# Altium project power_interface.PrjPcb
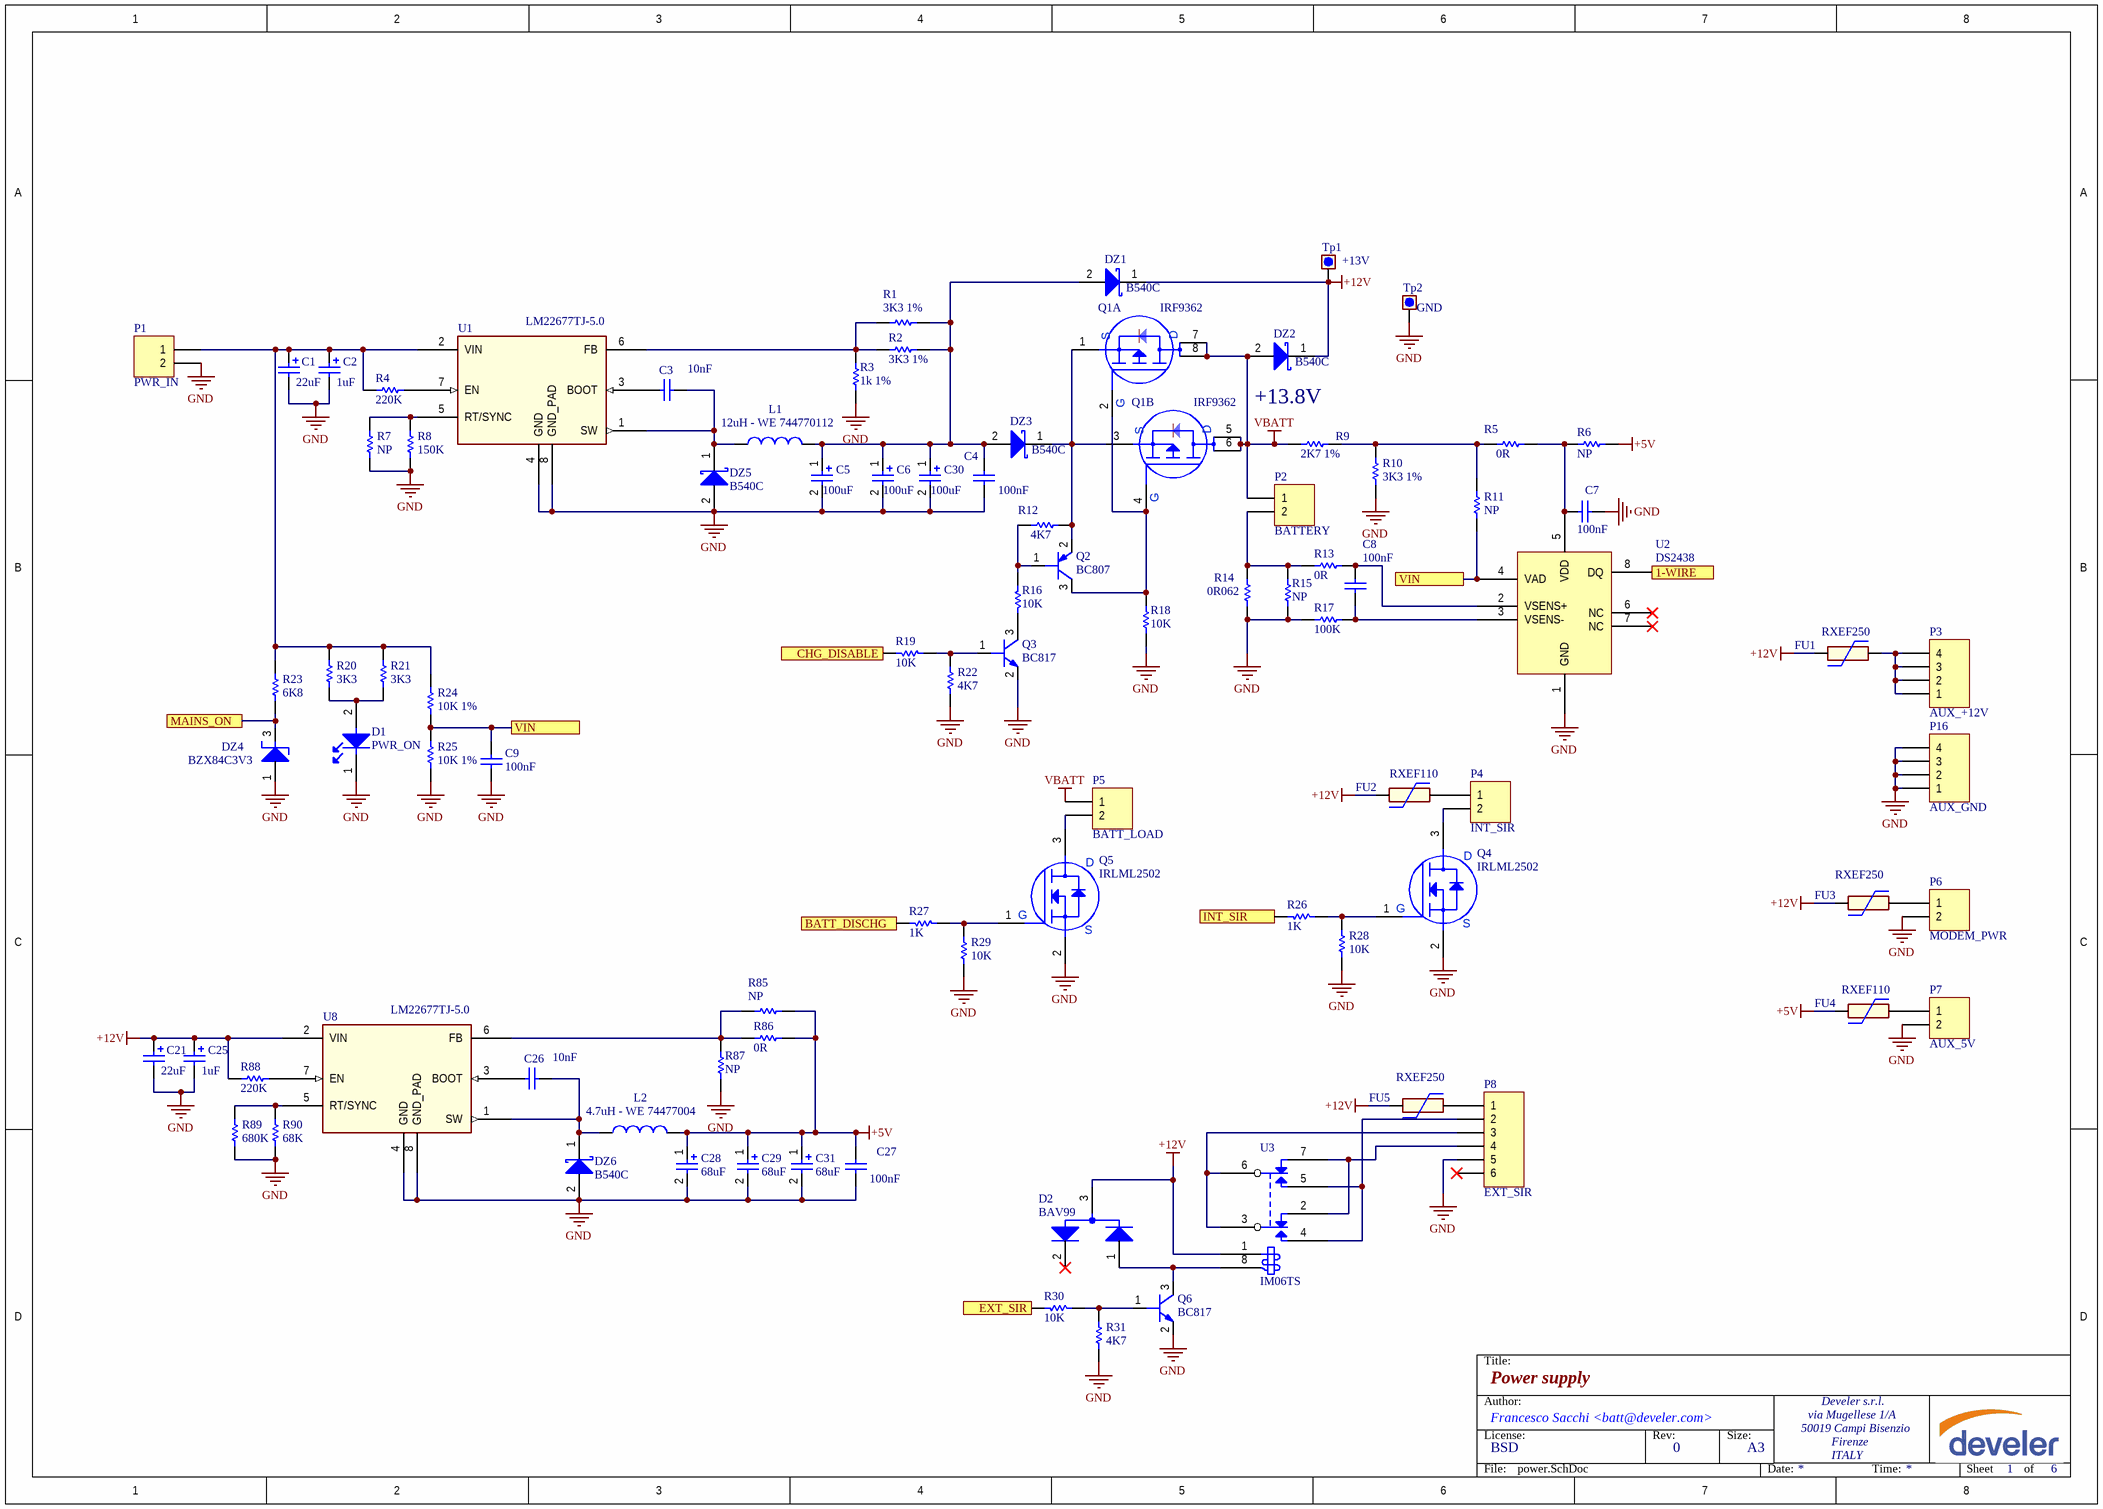
[diagram p0: power.SchDoc]
Title: Test
3 sheets, 181 parts. Net scope: flat (ports and power ports of the same name join across sheets).
Board file: power_interface.PcbDoc
Sheets:
  power.SchDoc
  interface.SchDoc
  raspberry_connector.SchDoc

## Sheet power.SchDoc: Power supply
size A3; Author: Francesco Sacchi <batt@develer.com>; Organization: Develer s.r.l.; Address1: via Mugellese 1/A; Address2: 50019 Campi Bisenzio; Address3: Firenze; Address4: ITALY; DocumentNumber: 1; Revision: 0; SheetNumber: 1; SheetTotal: 6

### Parts
C1  22uF  [1206_[3216]]
C2  1uF  [1206_[3216]]
C3  10nF  [0603_[1608]]
C4  100nF  [0603_[1608]]
C5  100uF  [[7343]_CAP_TAN]
C6  100uF  [[7343]_CAP_TAN]
C7  100nF  [0603_[1608]]
C8  100nF  [0603_[1608]]
C9  100nF  [0603_[1608]]
C21  22uF  [1206_[3216]]
C25  1uF  [1206_[3216]]
C26  10nF  [0603_[1608]]
C27  100nF  [0603_[1608]]
C28  68uF  [[7343]_CAP_TAN]
C29  68uF  [[7343]_CAP_TAN]
C30  100uF  [[7343]_CAP_TAN]
C31  68uF  [[7343]_CAP_TAN]
D1  PWR_ON  [0805_[2012]_LED]
D2  BAV99  [SOT-23]
DZ1  B540C  [DO214AB_K1-A2_SMC]
DZ2  B540C  [DO214AB_K1-A2_SMC]
DZ3  B540C  [DO214AB_K1-A2_SMC]
DZ4  BZX84C3V3  [SOT-23_L]
DZ5  B540C  [DO214AB_K1-A2_SMC]
DZ6  B540C  [DO214AB_K1-A2_SMC]
FU1  RXEF250  [RADIAL-10.2mm-polyswitch]
FU2  RXEF110  [RADIAL_5.08mm_polyswitch]
FU3  RXEF250  [RADIAL-10.2mm-polyswitch]
FU4  RXEF110  [RADIAL_5.08mm_polyswitch]
FU5  RXEF250  [RADIAL-10.2mm-polyswitch]
L1  12uH - WE 744770112  [WE-PD_1280]
L2  4.7uH - WE 74477004  [WE-PD_1280]
P1  PWR_IN  [TBLOCK_1X2_3.5MM_HOR_THD]
P2  BATTERY  [TBLOCK_1X2_3.5MM_HOR_THD]
P3  AUX_+12V  [TBLOCK_1X4_3.5MM_HOR_THD]
P4  INT_SIR  [TBLOCK_1X2_3.5MM_HOR_THD]
P5  BATT_LOAD  [TBLOCK_1X2_3.5MM_HOR_THD]
P6  MODEM_PWR  [TBLOCK_1X2_3.5MM_HOR_THD]
P7  AUX_5V  [TBLOCK_1X2_3.5MM_HOR_THD]
P8  EXT_SIR  [TBLOCK_1X6_3.5MM_HOR_THD]
P16  AUX_GND  [TBLOCK_1X4_3.5MM_HOR_THD]
Q1  IRF9362  [SOIC8]  (parts A,B of 2)
Q2  BC807  [SOT-23]
Q3  BC817  [SOT-23]
Q4  IRLML2502  [sot-23]
Q5  IRLML2502  [sot-23]
Q6  BC817  [SOT-23]
R1  3K3 1%  [0603_[1608]]
R2  3K3 1%  [0603_[1608]]
R3  1k 1%  [0603_[1608]]
R4  220K  [0603_[1608]]
R5  0R  [0603_[1608]]
R6  NP  [0603_[1608]]
R7  NP  [0603_[1608]]
R8  150K  [0603_[1608]]
R9  2K7 1%  [0603_[1608]]
R10  3K3 1%  [0603_[1608]]
R11  NP  [0603_[1608]]
R12  4K7  [0603_[1608]]
R13  0R  [0603_[1608]]
R14  0R062  [1020_[2550]]
R15  NP  [0603_[1608]]
R16  10K  [0603_[1608]]
R17  100K  [0603_[1608]]
R18  10K  [0603_[1608]]
R19  10K  [0603_[1608]]
R20  3K3  [0603_[1608]]
R21  3K3  [0603_[1608]]
R22  4K7  [0603_[1608]]
R23  6K8  [0603_[1608]]
R24  10K 1%  [0603_[1608]]
R25  10K 1%  [0603_[1608]]
R26  1K  [0603_[1608]]
R27  1K  [0603_[1608]]
R28  10K  [0603_[1608]]
R29  10K  [0603_[1608]]
R30  10K  [0603_[1608]]
R31  4K7  [0603_[1608]]
R85  NP  [0603_[1608]]
R86  0R  [0603_[1608]]
R87  NP  [0603_[1608]]
R88  220K  [0603_[1608]]
R89  680K  [0603_[1608]]
R90  68K  [0603_[1608]]
Tp1  +13V  [TEST_POINT_THD_D1.6MM]  (no BOM)
Tp2  GND  [TEST_POINT_THD_D1.6MM]  (no BOM)
U1  LM22677TJ-5.0  [TO-263-7]
U2  DS2438  [SOIC8]
U3  IM06TS  [RELAYS_DPST_THD_6x10_3.2mm]
U8  LM22677TJ-5.0  [TO-263-7]

### Ports
1-WIRE, BATT_DISCHG, CHG_DISABLE, EXT_SIR, INT_SIR, MAINS_ON, VIN

### Nets
+5V: C27.2 C28.1 C29.1 C31.1 FU4.1 L2.2 R6.1 R85.1 R86.1
+12V: C21.1 C25.1 D2.3 DZ1.1(K) DZ2.1(K) FU1.1 FU2.1 FU3.1 FU5.1 R88.1 Tp1.1 U3.1 U8.2(VIN)
GND: C1.2 C2.2 C4.1 C5.2 C6.2 C7.1 C9.1 C21.2 C25.2 C27.1 C28.2 C29.2 C30.2 C31.2 D1.1(K) DZ4.1(A) DZ5.2(A) DZ6.2(A) P1.2 P6.2 P7.2 P8.5 P16.1 P16.2 P16.3 P16.4 Q3.2(E) Q4.2(S) Q5.2(S) Q6.2(E) R3.2 R7.1 R8.1 R10.1 R14.2 R15.2 R17.1 R18.1 R22.1 R25.1 R28.1 R29.1 R31.1 R87.2 R89.1 R90.1 Tp2.1 U1.4(GND) U1.8(GND_PAD) U2.1(GND) U8.4(GND) U8.8(GND_PAD)
VBATT: DZ2.2(A) P2.1 P5.1 Q1.5(D) Q1.6(D) Q1.7(D) Q1.8(D) R9.2
1-WIRE: U2.8(DQ) ; port 1-WIRE
BATT_DISCHG: R27.1 ; port BATT_DISCHG
CHG_DISABLE: R19.1 ; port CHG_DISABLE
EXT_SIR: R30.1 ; port EXT_SIR
INT_SIR: R26.1 ; port INT_SIR
MAINS_ON: DZ4.3(K) R23.1 ; port MAINS_ON
VIN: C9.2 R11.1 R24.1 R25.2 U2.4(VAD) ; port VIN
NetC1_1: C1.1 C2.1 P1.1 R4.1 R20.2 R21.2 R23.2 R24.2 U1.2(VIN)
NetC3_1: C3.1 U1.3(BOOT)
NetC3_2: C3.2 DZ5.1(K) L1.1 U1.1(SW)
NetC4_2: C4.2 C5.1 C6.1 C30.1 DZ1.2(A) DZ3.2(A) L1.2 R1.1 R2.1
NetC7_2: C7.2 R5.1 R6.2 U2.5(VDD)
NetC8_1: C8.1 R17.2 U2.3(VSENS-)
NetC8_2: C8.2 R13.2 U2.2(VSENS+)
NetC26_1: C26.1 U8.3(BOOT)
NetC26_2: C26.2 DZ6.1(K) L2.1 U8.1(SW)
NetD1_2: D1.2(A) R20.1 R21.1
NetD2_1: D2.1 Q6.3(C) U3.8
NetDZ3_1: DZ3.1(K) Q1.1(S) Q1.3(S) Q2.2(E) R12.2
NetFU1_2: FU1.2 P3.1 P3.2 P3.3 P3.4
NetFU2_2: FU2.2 P4.1
NetFU3_2: FU3.2 P6.1
NetFU4_2: FU4.2 P7.1
NetFU5_2: FU5.2 P8.1
NetP2_2: P2.2 R13.1 R14.1 R15.1
NetP4_2: P4.2 Q4.3(D)
NetP5_2: P5.2 Q5.3(D)
NetP8_2: P8.2 U3.4 U3.5
NetP8_3: P8.3 U3.3 U3.6
NetP8_4: P8.4 U3.2 U3.7
NetQ1_2: Q1.2(G) Q1.4(G) Q2.3(C) R18.2
NetQ2_1: Q2.1(B) R12.1 R16.2
NetQ3_1: Q3.1(B) R19.2 R22.2
NetQ3_3: Q3.3(C) R16.1
NetQ4_1: Q4.1(G) R26.2 R28.2
NetQ5_1: Q5.1(G) R27.2 R29.2
NetQ6_1: Q6.1(B) R30.2 R31.2
NetR1_2: R1.2 R2.2 R3.1 U1.6(FB)
NetR4_2: R4.2 U1.7(EN)
NetR5_2: R5.2 R9.1 R10.2 R11.2
NetR7_2: R7.2 R8.2 U1.5(RT/SYNC)
NetR85_2: R85.2 R86.2 R87.1 U8.6(FB)
NetR88_2: R88.2 U8.7(EN)
NetR89_2: R89.2 R90.2 U8.5(RT/SYNC)

Not connected (* = marked no-connect by the designer): D2 2*; P8 6*; U2 6(NC)* 7(NC)*

### Notes on the sheet
- +13.8V
- Title:
- Author:
- License:
- BSD
- Rev:
- Size:
- A3
- File:
- Date:
- Time:
- Sheet
- of

### Library data of the parts
C1 C2 C21 C25 = Cap Pol1: Ceramic X7R 50V; Value: 10uF; Published: 8-Jun-2000; Revision: July-2002: Re-released for DXP Platform.; Publisher: Altium Limited
C3 C4 C7-C9 C26 C27 = Cap: Ceramic X7R 50V; Value: 100pF; Published: 8-Jun-2000; LatestRevisionDate: 17-Jul-2002; LatestRevisionNote: Re-released for DXP Platform.; PackageReference: RAD-0.3; Publisher: Altium Limited; PackageDescription: Radial Cap, Thru-Hole; 2 Leads; 0.3 in Pin Spacing
C5 C6 C28-C31 = Cap Pol1: Tantalum 25V T491X107K025AT; Value: 10uF; Published: 8-Jun-2000; Revision: July-2002: Re-released for DXP Platform.; Publisher: Altium Limited
D1 = LED: Multicolor LED
D2 = BAV99: SOT23
DZ1-DZ3 DZ5 DZ6 = D Schottky: Diode Schottky (SSC54); Published: 8-Jun-2000; LatestRevisionDate: 17-Jul-2002; LatestRevisionNote: Re-released for DXP Platform.; PackageReference: SMB; Publisher: Altium Limited; PackageDescription: DO-214-AA/SMB; 2 C-Bend Leads; Body 5.3 x 3.6 mm, inc. leads (LxW); Code_JEDEC: DO-214-AA
DZ4 = ZENER_BZX: Zener 0.35W
FU1-FU5 = FuseAutoReset: Fuse autoreset
L1 L2 = Inductor: SMD Shielded Tiny Power Inductor; Code_IEC: 1005; Value: 10mH; Published: 8-Jun-2000; LatestRevisionDate: 29-May-2009; LatestRevisionNote: IPC-7351 Footprint Added.; PackageReference: 0402-A; Publisher: Altium Limited; PackageDescription: Chip Inductor; Code_JEITA: 0402
P1 P2 P4-P7 = Header 2: Header, 2-Pin; LatestRevisionDate: 17-Jul-2002; LatestRevisionNote: Re-released for DXP Platform.; Publisher: Altium Limited
P3 P16 = Header 4: Header, 4-Pin; LatestRevisionDate: 17-Jul-2002; LatestRevisionNote: Re-released for DXP Platform.; Publisher: Altium Limited
P8 = Header 6: Header, 6-Pin; LatestRevisionDate: 17-Jul-2002; LatestRevisionNote: Re-released for DXP Platform.; Publisher: Altium Limited
Q1 = MOSFET-P dual: Dual channel P-MOS in same package
Q2 = BC807: PNP Trasistor
Q3 Q6 = BC817: NPN Transistor
Q4 Q5 = MOSFET-N 3pin: N MOS
R1-R31 R85-R90 = Res1: Resistor; Revision: July-2002: Re-released for DXP Platform.
Tp1 Tp2 = Test_point
U1 U8 = LM22670TJ-ADJ: Switching regulator.
U2 = DS2438: Smart Battery Monitor
U3 = RELAY DPST

## Sheet interface.SchDoc: Interface
size A3; Author: Francesco Sacchi <batt@develer.com>; Organization: Develer s.r.l.; Address1: via Mugellese 1/A; Address2: 50019 Campi Bisenzio; Address3: Firenze; Address4: ITALY; DocumentNumber: 1; Revision: 0; SheetNumber: 1; SheetTotal: 6
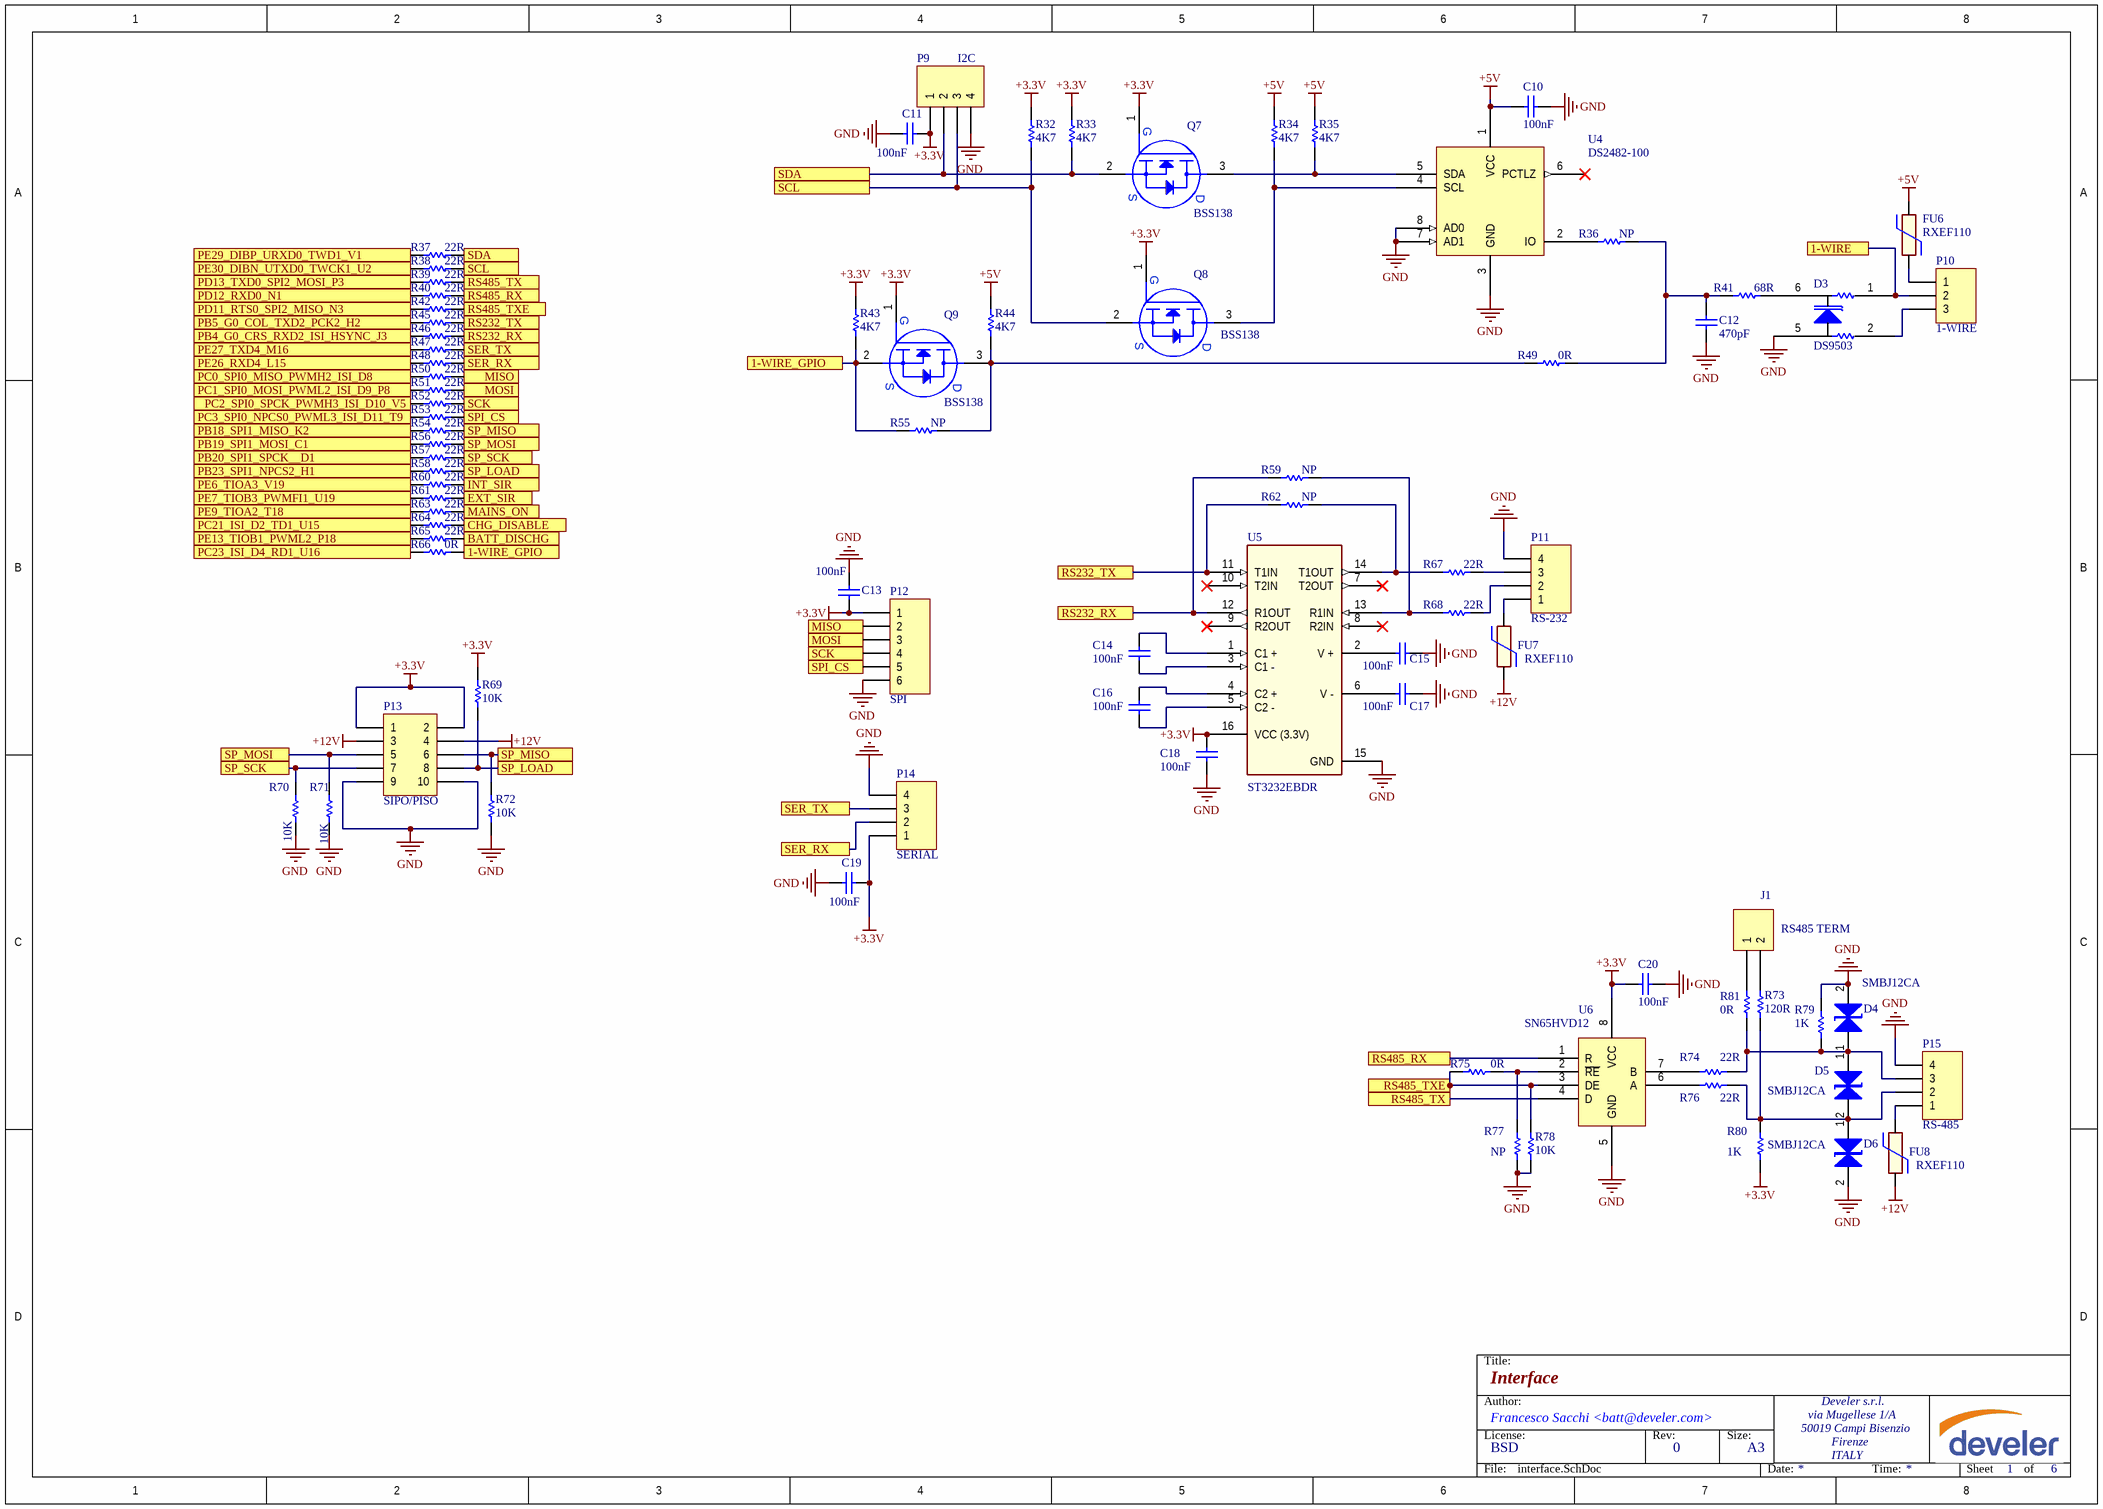
[diagram p1: interface.SchDoc]

### Parts
(Parts that share a designator on the sheet are numbered #1, #2 ... from top to bottom, then left to right.)
C10  100nF  [0603_[1608]]
C11  100nF  [0603_[1608]]
C12  470pF  [0603_[1608]]
C13  100nF  [0603_[1608]]
C14  100nF  [0603_[1608]]
C15  100nF  [0603_[1608]]
C16  100nF  [0603_[1608]]
C17  100nF  [0603_[1608]]
C18  100nF  [0603_[1608]]
C19  100nF  [0603_[1608]]
C20  100nF  [0603_[1608]]
D3  DS9503  [TSOC6]
D4  SMBJ12CA  [DO214AA_12]
D5  SMBJ12CA  [DO214AA_12]
D6  SMBJ12CA  [DO214AA_12]
FU6  RXEF110  [RADIAL_5.08mm_polyswitch]
FU7  RXEF110  [RADIAL_5.08mm_polyswitch]
FU8  RXEF110  [RADIAL_5.08mm_polyswitch]
J1  RS485 TERM  [HEADER_1X2_2.54MM_THD]
P9  I2C  [HEADER_1X4_2.54MM_THD]
P10  1-WIRE  [TBLOCK_1X3_3.5MM_HOR_THD]
P11  RS-232  [TBLOCK_1X4_3.5MM_HOR_THD]
P12  SPI  [HEADER_1X6_2.54MM_THD]
P13  SIPO/PISO  [HEADER_2X5_2.54MM_THD_BOXED]
P14  SERIAL  [HEADER_1X4_2.54MM_THD]
P15  RS-485  [TBLOCK_1X4_3.5MM_HOR_THD]
Q7  BSS138  [sot-23]
Q8  BSS138  [sot-23]
Q9  BSS138  [sot-23]
R32  4K7  [0603_[1608]]
R33  4K7  [0603_[1608]]
R34  4K7  [0603_[1608]]
R35  4K7  [0603_[1608]]
R36  NP  [0603_[1608]]
R37  22R  [0603_[1608]]
R38  22R  [0603_[1608]]
R39  22R  [0603_[1608]]
R40  22R  [0603_[1608]]
R41  68R  [0603_[1608]]
R42  22R  [0603_[1608]]
R43  4K7  [0603_[1608]]
R44  4K7  [0603_[1608]]
R45  22R  [0603_[1608]]
R46  22R  [0603_[1608]]
R47  22R  [0603_[1608]]
R48  22R  [0603_[1608]]
R49  0R  [0603_[1608]]
R50  22R  [0603_[1608]]
R51  22R  [0603_[1608]]
R52  22R  [0603_[1608]]
R53  22R  [0603_[1608]]
R54  22R  [0603_[1608]]
R55  NP  [0603_[1608]]
R56  22R  [0603_[1608]]
R57  22R  [0603_[1608]]
R58  22R  [0603_[1608]]
R59  NP  [0603_[1608]]
R60  22R  [0603_[1608]]
R61  22R  [0603_[1608]]
R62  NP  [0603_[1608]]
R63  22R  [0603_[1608]]
R64  22R  [0603_[1608]]
R65  22R  [0603_[1608]]
R66  0R  [0603_[1608]]
R67  22R  [0603_[1608]]
R68  22R  [0603_[1608]]
R69  10K  [0603_[1608]]
R70  10K  [0603_[1608]]
R71  10K  [0603_[1608]]
R72  10K  [0603_[1608]]
R73  120R  [0603_[1608]]
R74  22R  [0603_[1608]]
R75  0R  [0603_[1608]]
R76  22R  [0603_[1608]]
R77  NP  [0603_[1608]]
R78  10K  [0603_[1608]]
R79  1K  [0603_[1608]]
R80  1K  [0603_[1608]]
R81#1  0R  [0603_[1608]]
U4  DS2482-100  [SOIC8]
U5  ST3232EBDR  [SOIC16]
U6  SN65HVD12  [SOIC8]

### Ports
1-WIRE, 1-WIRE_GPIO, BATT_DISCHG, CHG_DISABLE, EXT_SIR, INT_SIR, MAINS_ON, MISO, MOSI, PB4_G0_CRS_RXD2_ISI_HSYNC_J3, PB5_G0_COL_TXD2_PCK2_H2, PB18_SPI1_MISO_K2, PB19_SPI1_MOSI_C1, PB20_SPI1_SPCK__D1, PB23_SPI1_NPCS2_H1, PC0_SPI0_MISO_PWMH2_ISI_D8, PC1_SPI0_MOSI_PWML2_ISI_D9_P8, PC2_SPI0_SPCK_PWMH3_ISI_D10_V5, PC3_SPI0_NPCS0_PWML3_ISI_D11_T9, PC21_ISI_D2_TD1_U15, PC23_ISI_D4_RD1_U16, PD11_RTS0_SPI2_MISO_N3, PD12_RXD0_N1, PD13_TXD0_SPI2_MOSI_P3, PE6_TIOA3_V19, PE7_TIOB3_PWMFI1_U19, PE9_TIOA2_T18, PE13_TIOB1_PWML2_P18, PE26_RXD4_L15, PE27_TXD4_M16, PE29_DIBP_URXD0_TWD1_V1, PE30_DIBN_UTXD0_TWCK1_U2, RS232_RX, RS232_TX, RS485_RX, RS485_TX, RS485_TXE, SCK, SCL, SDA, SER_RX, SER_TX, SP_LOAD, SP_MISO, SP_MOSI, SP_SCK, SPI_CS

### Nets
+3.3V: C11.2 C13.2 C18.2 C19.2 C20.2 P9.1 P12.1 P13.1 P13.2 P14.1 Q7.1(G) Q8.1(G) Q9.1(G) R32.2 R33.2 R43.2 R69.2 R80.1 U5.16(VCC_(3.3V)) U6.8(VCC)
+5V: C10.2 FU6.1 R34.2 R35.2 R44.2 U4.1(VCC)
+12V: FU7.1 FU8.1 P13.3 P13.4
GND: C10.1 C11.1 C12.2 C13.1 C15.1 C17.1 C18.1 C19.1 C20.1 D3.5 D4.2 D6.2 P9.4 P11.4 P12.6 P13.9 P13.10 P14.4 P15.4 R70.1 R71.1 R72.1 R77.1 R78.1 R79.2 U4.3(GND) U4.7(AD1) U4.8(AD0) U5.15(GND) U6.5(GND)
1-WIRE: D3.1 P10.2 ; port 1-WIRE
1-WIRE_GPIO: Q9.2(S) R43.1 R55.1 R66.2 ; port 1-WIRE_GPIO
1-WIRE_GPIO_RPI: R66.1 ; port PC23_ISI_D4_RD1_U16
BATT_DISCHG: R65.2 ; port BATT_DISCHG
BATT_DISCHG_RPI: R65.1 ; port PE13_TIOB1_PWML2_P18
CHG_DISABLE: R64.2 ; port CHG_DISABLE
CHG_DISABLE_RPI: R64.1 ; port PC21_ISI_D2_TD1_U15
EXT_SIR: R61.2 ; port EXT_SIR
EXT_SIR_RPI: R61.1 ; port PE7_TIOB3_PWMFI1_U19
INT_SIR: R60.2 ; port INT_SIR
INT_SIR_RPI: R60.1 ; port PE6_TIOA3_V19
MAINS_ON: R63.2 ; port MAINS_ON
MAINS_ON_RPI: R63.1 ; port PE9_TIOA2_T18
MISO: P12.2 R50.2 ; port MISO
MISO_RPI: R50.1 ; port PC0_SPI0_MISO_PWMH2_ISI_D8
MOSI: P12.3 R51.2 ; port MOSI
MOSI_RPI: R51.1 ; port PC1_SPI0_MOSI_PWML2_ISI_D9_P8
PB4_G0_CRS_RXD2_ISI_HSYNC_J3: R46.1 ; port PB4_G0_CRS_RXD2_ISI_HSYNC_J3
PB5_G0_COL_TXD2_PCK2_H2: R45.1 ; port PB5_G0_COL_TXD2_PCK2_H2
PB18_SPI1_MISO_K2: R54.1 ; port PB18_SPI1_MISO_K2
PB19_SPI1_MOSI_C1: R56.1 ; port PB19_SPI1_MOSI_C1
PB20_SPI1_SPCK__D1: R57.1 ; port PB20_SPI1_SPCK__D1
PB23_SPI1_NPCS2_H1: R58.1 ; port PB23_SPI1_NPCS2_H1
PC2_SPI0_SPCK_PWMH3_ISI_D10_V5: R52.1 ; port PC2_SPI0_SPCK_PWMH3_ISI_D10_V5
PC3_SPI0_NPCS0_PWML3_ISI_D11_T9: R53.1 ; port PC3_SPI0_NPCS0_PWML3_ISI_D11_T9
PD11_RTS0_SPI2_MISO_N3: R42.1 ; port PD11_RTS0_SPI2_MISO_N3
PD12_RXD0_N1: R40.1 ; port PD12_RXD0_N1
PD13_TXD0_SPI2_MOSI_P3: R39.1 ; port PD13_TXD0_SPI2_MOSI_P3
PE26_RXD4_L15: R48.1 ; port PE26_RXD4_L15
PE27_TXD4_M16: R47.1 ; port PE27_TXD4_M16
PE29_DIBP_URXD0_TWD1_V1: R37.1 ; port PE29_DIBP_URXD0_TWD1_V1
PE30_DIBN_UTXD0_TWCK1_U2: R38.1 ; port PE30_DIBN_UTXD0_TWCK1_U2
RS232_RX: R46.2 R59.1 U5.12(R1OUT) ; port RS232_RX
RS232_TX: R45.2 R62.1 U5.11(T1IN) ; port RS232_TX
RS485_RX: R40.2 U6.1(R) ; port RS485_RX
RS485_TX: R39.2 U6.4(D) ; port RS485_TX
RS485_TXE: R42.2 R75.2 R78.2 U6.3(DE) ; port RS485_TXE
SCK: P12.4 R52.2 ; port SCK
SCL: P9.3 Q8.2(S) R32.1 R38.2 ; port SCL
SDA: P9.2 Q7.2(S) R33.1 R37.2 ; port SDA
SER_RX: P14.2 R48.2 ; port SER_RX
SER_TX: P14.3 R47.2 ; port SER_TX
SP_LOAD: P13.8 R58.2 R69.1 ; port SP_LOAD
SP_MISO: P13.6 R54.2 R72.2 ; port SP_MISO
SP_MOSI: P13.5 R56.2 R71.2 ; port SP_MOSI
SP_SCK: P13.7 R57.2 R70.2 ; port SP_SCK
SPI_CS: P12.5 R53.2 ; port SPI_CS
NetC12_1: C12.1 R36.2 R41.1 R49.2
NetC14_1: C14.1 U5.1(C1_+)
NetC14_2: C14.2 U5.3(C1_-)
NetC15_2: C15.2 U5.2(V_+)
NetC16_1: C16.1 U5.5(C2_-)
NetC16_2: C16.2 U5.4(C2_+)
NetC17_2: C17.2 U5.6(V_-)
NetD3_2: D3.2 P10.3
NetD3_6: D3.6 R41.2
NetD4_1: D4.1 D5.1 P15.3 R74.2 R79.1 R81#1.2
NetD5_2: D5.2 D6.1 P15.2 R73.2 R76.2 R80.2
NetFU6_2: FU6.2 P10.1
NetFU7_2: FU7.2 P11.1
NetFU8_2: FU8.2 P15.1
NetJ1_1: J1.1 R81#1.1
NetJ1_2: J1.2 R73.1
NetP11_2: P11.2 R68.2
NetP11_3: P11.3 R67.2
NetQ7_3: Q7.3(D) R35.1 U4.5(SDA)
NetQ8_3: Q8.3(D) R34.1 U4.4(SCL)
NetQ9_3: Q9.3(D) R44.1 R49.1 R55.2
NetR36_1: R36.1 U4.2(IO)
NetR59_2: R59.2 R68.1 U5.13(R1IN)
NetR62_2: R62.2 R67.1 U5.14(T1OUT)
NetR74_1: R74.1 U6.7(B)
NetR75_1: R75.1 R77.2 U6.2(~{RE})
NetR76_1: R76.1 U6.6(A)

Not connected (* = marked no-connect by the designer): U4 6(PCTLZ)*; U5 7(T2OUT)* 8(R2IN)* 9(R2OUT)* 10(T2IN)*

### Notes on the sheet
- Title:
- Author:
- License:
- BSD
- Rev:
- Size:
- A3
- File:
- Date:
- Time:
- Sheet
- of

### Library data of the parts
C10-C20 = Cap: Ceramic X7R 50V; Value: 100pF; Published: 8-Jun-2000; LatestRevisionDate: 17-Jul-2002; LatestRevisionNote: Re-released for DXP Platform.; PackageReference: RAD-0.3; Publisher: Altium Limited; PackageDescription: Radial Cap, Thru-Hole; 2 Leads; 0.3 in Pin Spacing
D3 = DS9503: ESD Protection Diode with Resistors
D4-D6 = TVS bi: TVS bidirectional
FU6-FU8 = FuseAutoReset: Fuse autoreset
J1 = Header 2: Pin Header, 2.54mm, 1x2, 2pin; LatestRevisionDate: 17-Jul-2002; LatestRevisionNote: Re-released for DXP Platform.; Publisher: Altium Limited
P9 P11 P14 P15 = Header 4: Header, 4-Pin; LatestRevisionDate: 17-Jul-2002; LatestRevisionNote: Re-released for DXP Platform.; Publisher: Altium Limited
P10 = Header 3: Header, 3-Pin; LatestRevisionDate: 17-Jul-2002; LatestRevisionNote: Re-released for DXP Platform.; Publisher: Altium Limited
P12 = Header 6: Header, 6-Pin; LatestRevisionDate: 17-Jul-2002; LatestRevisionNote: Re-released for DXP Platform.; Publisher: Altium Limited
P13 = Header 5X2: Header, 5-Pin, Dual row; LatestRevisionDate: 17-Jul-2002; LatestRevisionNote: Re-released for DXP Platform.; Publisher: Altium Limited
Q7-Q9 = MOSFET-N 3pin: N MOS
R32-R80 R81#1 = Res1: Resistor; Revision: July-2002: Re-released for DXP Platform.
U4 = DS2482-100: Single-Channel 1-Wire Master
U5 = ST3232CDR: 3 to 5.5 V, low power, up to 400 kbps RS-232 driver; Part Number: STm ST3232CDR; Purchase Code: Digikey 497-3731-6-ND
U6 = SN65HVD12: 3.3V to RS485 interface

## Sheet raspberry_connector.SchDoc: DevelBoard EVA Main Connectors
size A3; Author: Daniele Basile <asterix@develer.com>; Organization: Develer s.r.l.; Address1: via Mugellese 1/A; Address2: 50019 Campi Bisenzio; Address3: Firenze; Address4: ITALY; DocumentNumber: 1; Revision: EVA 0; SheetNumber: 1; SheetTotal: 3
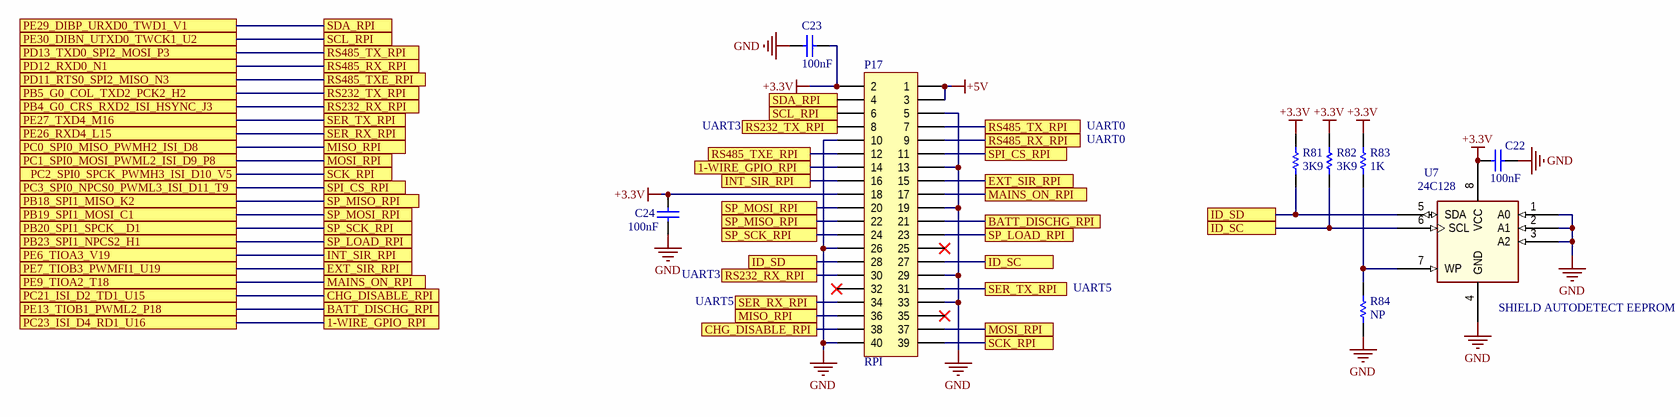
[diagram p2: raspberry_connector.SchDoc]

### Parts
(Parts that share a designator on the sheet are numbered #1, #2 ... from top to bottom, then left to right.)
C22  100nF  [0603_[1608]]
C23  100nF  [0603_[1608]]
C24  100nF  [0603_[1608]]
P17  RPI  [SOCKET_2x20_2.54MM_THD]
R81#2  3K9  [0603_[1608]]
R82  3K9  [0603_[1608]]
R83  1K  [0603_[1608]]
R84  NP  [0603_[1608]]
U7  24C128  [SOIC8]

### Ports
1-WIRE_GPIO_RPI, BATT_DISCHG_RPI, CHG_DISABLE_RPI, EXT_SIR_RPI, ID_SC, ID_SD, INT_SIR_RPI, MAINS_ON_RPI, MISO_RPI, MOSI_RPI, PB4_G0_CRS_RXD2_ISI_HSYNC_J3, PB5_G0_COL_TXD2_PCK2_H2, PB18_SPI1_MISO_K2, PB19_SPI1_MOSI_C1, PB20_SPI1_SPCK__D1, PB23_SPI1_NPCS2_H1, PC0_SPI0_MISO_PWMH2_ISI_D8, PC1_SPI0_MOSI_PWML2_ISI_D9_P8, PC2_SPI0_SPCK_PWMH3_ISI_D10_V5, PC3_SPI0_NPCS0_PWML3_ISI_D11_T9, PC21_ISI_D2_TD1_U15, PC23_ISI_D4_RD1_U16, PD11_RTS0_SPI2_MISO_N3, PD12_RXD0_N1, PD13_TXD0_SPI2_MOSI_P3, PE6_TIOA3_V19, PE7_TIOB3_PWMFI1_U19, PE9_TIOA2_T18, PE13_TIOB1_PWML2_P18, PE26_RXD4_L15, PE27_TXD4_M16, PE29_DIBP_URXD0_TWD1_V1, PE30_DIBN_UTXD0_TWCK1_U2, RS232_RX_RPI, RS232_TX_RPI, RS485_RX_RPI, RS485_TX_RPI, RS485_TXE_RPI, SCK_RPI, SCL_RPI, SDA_RPI, SER_RX_RPI, SER_TX_RPI, SP_LOAD_RPI, SP_MISO_RPI, SP_MOSI_RPI, SP_SCK_RPI, SPI_CS_RPI

### Nets
+3.3V: C22.2 C23.2 C24.1 P17.2 P17.18 R81#2.2 R82.2 R83.2 U7.8(VCC)
+5V: P17.1 P17.3
GND: C22.1 C23.1 C24.2 P17.5 P17.10 P17.13 P17.19 P17.26 P17.29 P17.33 P17.40 R84.1 U7.1(A0) U7.2(A1) U7.3(A2) U7.4(GND)
1-WIRE_GPIO_RPI: P17.14 ; port 1-WIRE_GPIO_RPI, port PC23_ISI_D4_RD1_U16
BATT_DISCHG_RPI: P17.21 ; port BATT_DISCHG_RPI, port PE13_TIOB1_PWML2_P18
CHG_DISABLE_RPI: P17.38 ; port CHG_DISABLE_RPI, port PC21_ISI_D2_TD1_U15
EXT_SIR_RPI: P17.15 ; port EXT_SIR_RPI, port PE7_TIOB3_PWMFI1_U19
ID_SC: P17.27 R82.1 U7.6(SCL) ; port ID_SC
ID_SD: P17.28 R81#2.1 U7.5(SDA) ; port ID_SD
INT_SIR_RPI: P17.16 ; port INT_SIR_RPI, port PE6_TIOA3_V19
MAINS_ON_RPI: P17.17 ; port MAINS_ON_RPI, port PE9_TIOA2_T18
MISO_RPI: P17.36 ; port MISO_RPI, port PC0_SPI0_MISO_PWMH2_ISI_D8
MOSI_RPI: P17.37 ; port MOSI_RPI, port PC1_SPI0_MOSI_PWML2_ISI_D9_P8
PB4_G0_CRS_RXD2_ISI_HSYNC_J3: P17.30 ; port RS232_RX_RPI, port PB4_G0_CRS_RXD2_ISI_HSYNC_J3
PB5_G0_COL_TXD2_PCK2_H2: P17.8 ; port RS232_TX_RPI, port PB5_G0_COL_TXD2_PCK2_H2
PB18_SPI1_MISO_K2: P17.22 ; port SP_MISO_RPI, port PB18_SPI1_MISO_K2
PB19_SPI1_MOSI_C1: P17.20 ; port SP_MOSI_RPI, port PB19_SPI1_MOSI_C1
PB20_SPI1_SPCK__D1: P17.24 ; port SP_SCK_RPI, port PB20_SPI1_SPCK__D1
PB23_SPI1_NPCS2_H1: P17.23 ; port SP_LOAD_RPI, port PB23_SPI1_NPCS2_H1
PC2_SPI0_SPCK_PWMH3_ISI_D10_V5: P17.39 ; port SCK_RPI, port PC2_SPI0_SPCK_PWMH3_ISI_D10_V5
PC3_SPI0_NPCS0_PWML3_ISI_D11_T9: P17.11 ; port SPI_CS_RPI, port PC3_SPI0_NPCS0_PWML3_ISI_D11_T9
PD11_RTS0_SPI2_MISO_N3: P17.12 ; port RS485_TXE_RPI, port PD11_RTS0_SPI2_MISO_N3
PD12_RXD0_N1: P17.9 ; port RS485_RX_RPI, port PD12_RXD0_N1
PD13_TXD0_SPI2_MOSI_P3: P17.7 ; port RS485_TX_RPI, port PD13_TXD0_SPI2_MOSI_P3
PE26_RXD4_L15: P17.34 ; port SER_RX_RPI, port PE26_RXD4_L15
PE27_TXD4_M16: P17.31 ; port SER_TX_RPI, port PE27_TXD4_M16
PE29_DIBP_URXD0_TWD1_V1: P17.4 ; port SDA_RPI, port PE29_DIBP_URXD0_TWD1_V1
PE30_DIBN_UTXD0_TWCK1_U2: P17.6 ; port SCL_RPI, port PE30_DIBN_UTXD0_TWCK1_U2
NetR83_1: R83.1 R84.2 U7.7(WP)

Not connected (* = marked no-connect by the designer): P17 25* 32* 35*

### Notes on the sheet
- UART3
- UART0
- (near C24) UART3
- UART5
- (near U7) SHIELD AUTODETECT EEPROM
- Title:
- Author:
- License:
- BSD
- Rev:
- Size:
- A3
- File:
- Date:
- Time:
- Sheet
- of

### Library data of the parts
C22-C24 = Cap: Ceramic X7R 50V; Value: 10nF; Published: 8-Jun-2000; Revision: July-2002: Re-released for DXP Platform.; Publisher: Altium Limited
P17 = Header 20X2: Header, 20-Pin, Dual row; LatestRevisionDate: 17-Jul-2002; LatestRevisionNote: Re-released for DXP Platform.; Publisher: Altium Limited
R81#2 R82-R84 = Res1: Resistor; Revision: July-2002: Re-released for DXP Platform.
U7 = EEPROM-SOIC8: EEPROM

## Nets that join several sheets
+3.3V: interface (20 pins), raspberry_connector (9 pins)
+5V: power (9 pins), interface (6 pins), raspberry_connector (P17.1 P17.3)
+12V: power (13 pins), interface (FU7.1 FU8.1 P13.3 P13.4)
GND: power (52 pins), interface (30 pins), raspberry_connector (16 pins)
1-WIRE: power (U2.8), interface (D3.1 P10.2)
1-WIRE_GPIO_RPI: interface (R66.1), raspberry_connector (P17.14)
BATT_DISCHG: power (R27.1), interface (R65.2)
BATT_DISCHG_RPI: interface (R65.1), raspberry_connector (P17.21)
CHG_DISABLE: power (R19.1), interface (R64.2)
CHG_DISABLE_RPI: interface (R64.1), raspberry_connector (P17.38)
EXT_SIR: power (R30.1), interface (R61.2)
EXT_SIR_RPI: interface (R61.1), raspberry_connector (P17.15)
INT_SIR: power (R26.1), interface (R60.2)
INT_SIR_RPI: interface (R60.1), raspberry_connector (P17.16)
MAINS_ON: power (DZ4.3 R23.1), interface (R63.2)
MAINS_ON_RPI: interface (R63.1), raspberry_connector (P17.17)
MISO_RPI: interface (R50.1), raspberry_connector (P17.36)
MOSI_RPI: interface (R51.1), raspberry_connector (P17.37)
PB4_G0_CRS_RXD2_ISI_HSYNC_J3: interface (R46.1), raspberry_connector (P17.30)
PB5_G0_COL_TXD2_PCK2_H2: interface (R45.1), raspberry_connector (P17.8)
PB18_SPI1_MISO_K2: interface (R54.1), raspberry_connector (P17.22)
PB19_SPI1_MOSI_C1: interface (R56.1), raspberry_connector (P17.20)
PB20_SPI1_SPCK__D1: interface (R57.1), raspberry_connector (P17.24)
PB23_SPI1_NPCS2_H1: interface (R58.1), raspberry_connector (P17.23)
PC2_SPI0_SPCK_PWMH3_ISI_D10_V5: interface (R52.1), raspberry_connector (P17.39)
PC3_SPI0_NPCS0_PWML3_ISI_D11_T9: interface (R53.1), raspberry_connector (P17.11)
PD11_RTS0_SPI2_MISO_N3: interface (R42.1), raspberry_connector (P17.12)
PD12_RXD0_N1: interface (R40.1), raspberry_connector (P17.9)
PD13_TXD0_SPI2_MOSI_P3: interface (R39.1), raspberry_connector (P17.7)
PE26_RXD4_L15: interface (R48.1), raspberry_connector (P17.34)
PE27_TXD4_M16: interface (R47.1), raspberry_connector (P17.31)
PE29_DIBP_URXD0_TWD1_V1: interface (R37.1), raspberry_connector (P17.4)
PE30_DIBN_UTXD0_TWCK1_U2: interface (R38.1), raspberry_connector (P17.6)